# Altium schematic sheet LIGHT.SchDoc
size 246 x 182 mm
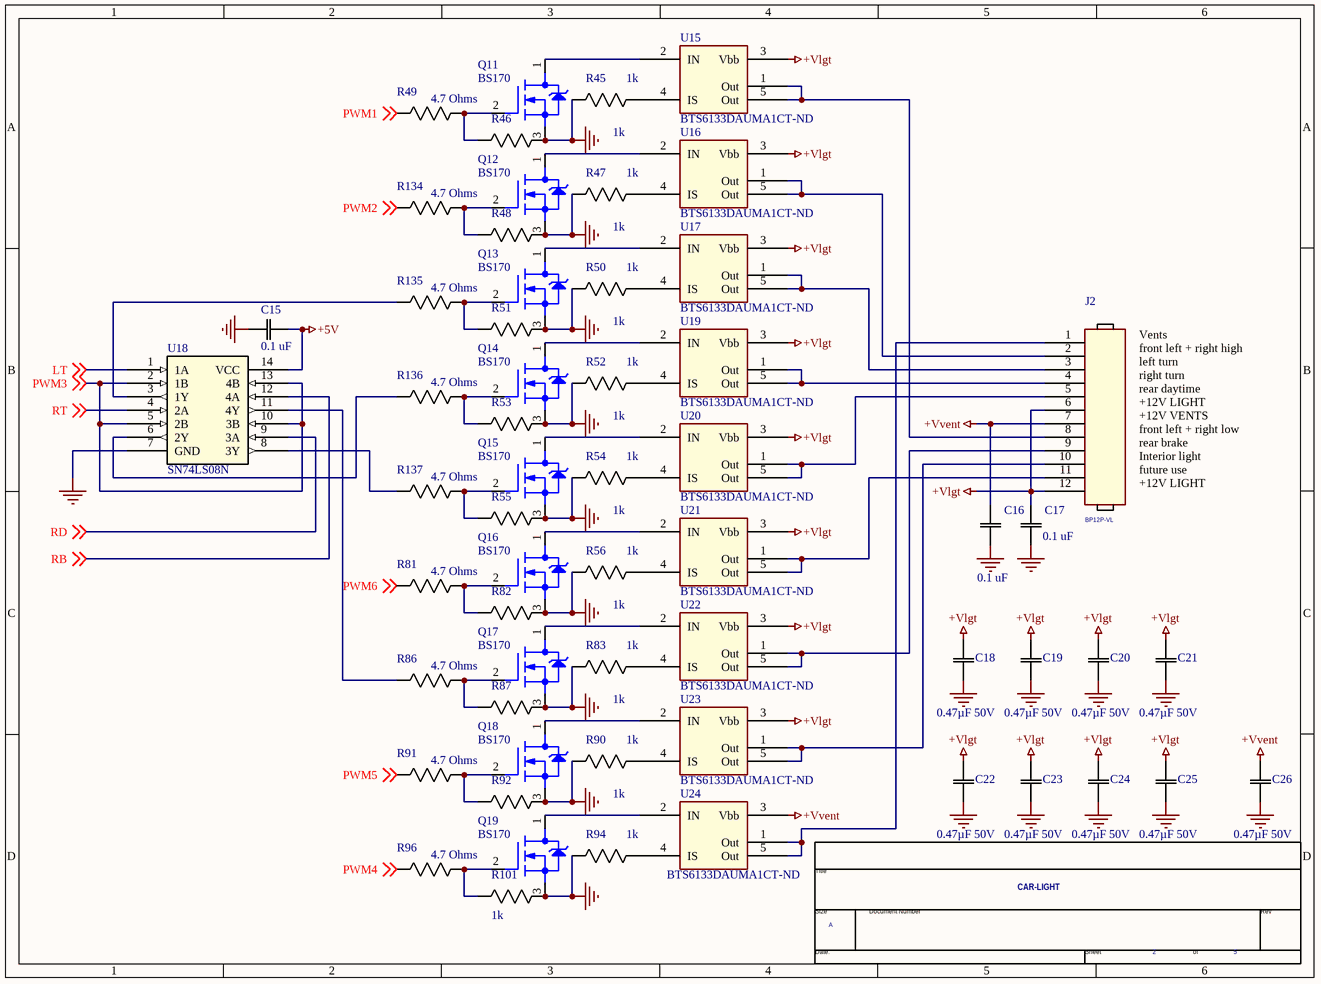
[diagram p0: LIGHT.SchDoc]

## Parts
*  Page Count: 5  Page Number: 2  Page Size: A  Title: CAR-LIGHT  (hidden comment: TitleBlock0)  (graphical)
C15  0.1 uF  [SR20]
C16  0.1 uF  [SR20]
C17  0.1 uF  [SR20]
C18  0.47µF 50V  [SR20]
C19  0.47µF 50V  [SR20]
C20  0.47µF 50V  [SR20]
C21  0.47µF 50V  [SR20]
C22  0.47µF 50V  [SR20]
C23  0.47µF 50V  [SR20]
C24  0.47µF 50V  [SR20]
C25  0.47µF 50V  [SR20]
C26  0.47µF 50V  [SR20]
J2  BP12P-VL  [MOLEX_0874271202]
Q11  BS170  [TO-92]
Q12  BS170  [TO-92]
Q13  BS170  [TO-92]
Q14  BS170  [TO-92]
Q15  BS170  [TO-92]
Q16  BS170  [TO-92]
Q17  BS170  [TO-92]
Q18  BS170  [TO-92]
Q19  BS170  [TO-92]
R45  1k  [RES AXIAL 1/6W]
R46  1k  [RES AXIAL 1/6W]
R47  1k  [RES AXIAL 1/6W]
R48  1k  [RES AXIAL 1/6W]
R49  4.7 Ohms  [RES AXIAL 1/6W]
R50  1k  [RES AXIAL 1/6W]
R51  1k  [RES AXIAL 1/6W]
R52  1k  [RES AXIAL 1/6W]
R53  1k  [RES AXIAL 1/6W]
R54  1k  [RES AXIAL 1/6W]
R55  1k  [RES AXIAL 1/6W]
R56  1k  [RES AXIAL 1/6W]
R81  4.7 Ohms  [RES AXIAL 1/6W]
R82  1k  [RES AXIAL 1/6W]
R83  1k  [RES AXIAL 1/6W]
R86  4.7 Ohms  [RES AXIAL 1/6W]
R87  1k  [RES AXIAL 1/6W]
R90  1k  [RES AXIAL 1/6W]
R91  4.7 Ohms  [RES AXIAL 1/6W]
R92  1k  [RES AXIAL 1/6W]
R94  1k  [RES AXIAL 1/6W]
R96  4.7 Ohms  [RES AXIAL 1/6W]
R101  1k  [RES AXIAL 1/6W]
R134  4.7 Ohms  [RES AXIAL 1/6W]
R135  4.7 Ohms  [RES AXIAL 1/6W]
R136  4.7 Ohms  [RES AXIAL 1/6W]
R137  4.7 Ohms  [RES AXIAL 1/6W]
U15  BTS6133DAUMA1CT-ND  [TO114P998X235-6_5N_L]
U16  BTS6133DAUMA1CT-ND  [TO114P998X235-6_5N_L]
U17  BTS6133DAUMA1CT-ND  [TO114P998X235-6_5N_L]
U18  SN74LS08N  [PDIP14_300MC]
U19  BTS6133DAUMA1CT-ND  [TO114P998X235-6_5N_L]
U20  BTS6133DAUMA1CT-ND  [TO114P998X235-6_5N_L]
U21  BTS6133DAUMA1CT-ND  [TO114P998X235-6_5N_L]
U22  BTS6133DAUMA1CT-ND  [TO114P998X235-6_5N_L]
U23  BTS6133DAUMA1CT-ND  [TO114P998X235-6_5N_L]
U24  BTS6133DAUMA1CT-ND  [TO114P998X235-6_5N_L]

## Nets
+5V: C15.1 U18.14(VCC)
+Vlgt: C17.2 C18.2 C19.2 C20.2 C21.2 C22.2 C23.2 C24.2 C25.2 J2.6 J2.12 U15.3(Vbb) U16.3(Vbb) U17.3(Vbb) U19.3(Vbb) U20.3(Vbb) U21.3(Vbb) U22.3(Vbb) U23.3(Vbb)
+Vvent: C16.2 C26.2 J2.7 U24.3(Vbb)
GND: C15.2 C16.1 C17.1 C18.1 C19.1 C20.1 C21.1 C22.1 C23.1 C24.1 C25.1 C26.1 Q11.3(S) Q12.3(S) Q13.3(S) Q14.3(S) Q15.3(S) Q16.3(S) Q17.3(S) Q18.3(S) Q19.3(S) R45.2 R46.1 R47.2 R48.1 R50.2 R51.1 R52.2 R53.1 R54.2 R55.1 R56.2 R82.1 R83.2 R87.1 R90.2 R92.1 R94.2 R101.1 U18.7(GND)
LT: U18.1(1A) ; off-sheet LT
PWM1: R49.2 ; off-sheet PWM1
PWM2: R134.2 ; off-sheet PWM2
PWM3: U18.2(1B) U18.5(2B) U18.10(3B) U18.13(4B) ; off-sheet PWM3
PWM4: R96.2 ; off-sheet PWM4
PWM5: R91.2 ; off-sheet PWM5
PWM6: R81.2 ; off-sheet PWM6
RB: U18.12(4A) ; off-sheet RB
RD: U18.9(3A) ; off-sheet RD
RT: U18.4(2A) ; off-sheet RT
NetJ2_1: J2.1 U24.1(Out) U24.5(Out)
NetJ2_2: J2.2 U16.1(Out) U16.5(Out)
NetJ2_3: J2.3 U17.1(Out) U17.5(Out)
NetJ2_4: J2.4 U19.1(Out) U19.5(Out)
NetJ2_5: J2.5 U20.1(Out) U20.5(Out)
NetJ2_8: J2.8 U15.1(Out) U15.5(Out)
NetJ2_9: J2.9 U22.1(Out) U22.5(Out)
NetJ2_10: J2.10 U23.1(Out) U23.5(Out)
NetJ2_11: J2.11 U21.1(Out) U21.5(Out)
NetQ11_1: Q11.1(D) U15.2(IN)
NetQ11_2: Q11.2(G) R46.2 R49.1
NetQ12_1: Q12.1(D) U16.2(IN)
NetQ12_2: Q12.2(G) R48.2 R134.1
NetQ13_1: Q13.1(D) U17.2(IN)
NetQ13_2: Q13.2(G) R51.2 R135.1
NetQ14_1: Q14.1(D) U19.2(IN)
NetQ14_2: Q14.2(G) R53.2 R136.1
NetQ15_1: Q15.1(D) U20.2(IN)
NetQ15_2: Q15.2(G) R55.2 R137.1
NetQ16_1: Q16.1(D) U21.2(IN)
NetQ16_2: Q16.2(G) R81.1 R82.2
NetQ17_1: Q17.1(D) U22.2(IN)
NetQ17_2: Q17.2(G) R86.1 R87.2
NetQ18_1: Q18.1(D) U23.2(IN)
NetQ18_2: Q18.2(G) R91.1 R92.2
NetQ19_1: Q19.1(D) U24.2(IN)
NetQ19_2: Q19.2(G) R96.1 R101.2
NetR45_1: R45.1 U15.4(IS)
NetR47_1: R47.1 U16.4(IS)
NetR50_1: R50.1 U17.4(IS)
NetR52_1: R52.1 U19.4(IS)
NetR54_1: R54.1 U20.4(IS)
NetR56_1: R56.1 U21.4(IS)
NetR83_1: R83.1 U22.4(IS)
NetR86_2: R86.2 U18.11(4Y)
NetR90_1: R90.1 U23.4(IS)
NetR94_1: R94.1 U24.4(IS)
NetR135_2: R135.2 U18.3(1Y)
NetR136_2: R136.2 U18.6(2Y)
NetR137_2: R137.2 U18.8(3Y)

## Notes on the sheet
- front left + right high
- left turn
- right turn
- rear daytime
- Vents
- front left + right low
- rear brake
- Interior light
- +12V VENTS
- +12V LIGHT
- future use
- (in symbol TitleBlock0) Title; Size; Document Number; Rev; Date:; Sheet; of

## Library data of the parts
C15-C17 = CAP RADIAL 2.54: 0.1µF ±10% 100V Ceramic Capacitor X7R Radial; Manufacturer_Part_Number: C320C104K1R5TA7301; Vendor: KEMET; Type: DEV; RefDes: RefDes; Value: 0.1 uF
C18-C26 = CAP RADIAL 2.54: CAP CER 0.47UF 50V X7R RADIAL; Manufacturer_Part_Number: C315C474K5R5TA7303; Vendor: KEMET; Type: DEV; RefDes: RefDes; Value: 0.47µF 50V
J2 = HEADER 12
Q11-Q19 = BS170: MOSFET N-CH 60V 500MA TO-92; Manufacturer_Part_Number: ON Semiconductor; Value: BS170
R45-R48 R50-R56 R82 R83 R87 R90 R92 R94 R101 = Resistor Axial  1/6W: RES 1K OHM 1/6W 5% AXIAL; Manufacturer_Part_Number: CFR-12JB-52-1K; Vendor: Yageo; RefDes: RefDes; Type: DEV; Value: 1k
R49 R81 R86 R91 R96 R134-R137 = Resistor Axial  1/6W: RES 4.7 OHM 1/6W 5% AXIAL; Manufacturer_Part_Number: CFR-12JB-52-4R7; Vendor: Yageo; RefDes: RefDes; Type: DEV; Value: 4.7 Ohms
U18 = SN74LS08N: IC GATE AND 4CH 2-INP 14DIP; Vendor: Texas Instruments; Built_By: EMA_UL_Team; C: Copyright (C) 2015 Accelerated Designs. All rights reserved; Manufacturer_Part_Number: SN74LS08N; RefDes: RefDes; Type: DEV; Value: SN74LS08N
* = TitleBlock0: Page Create Date: March  8, 1995